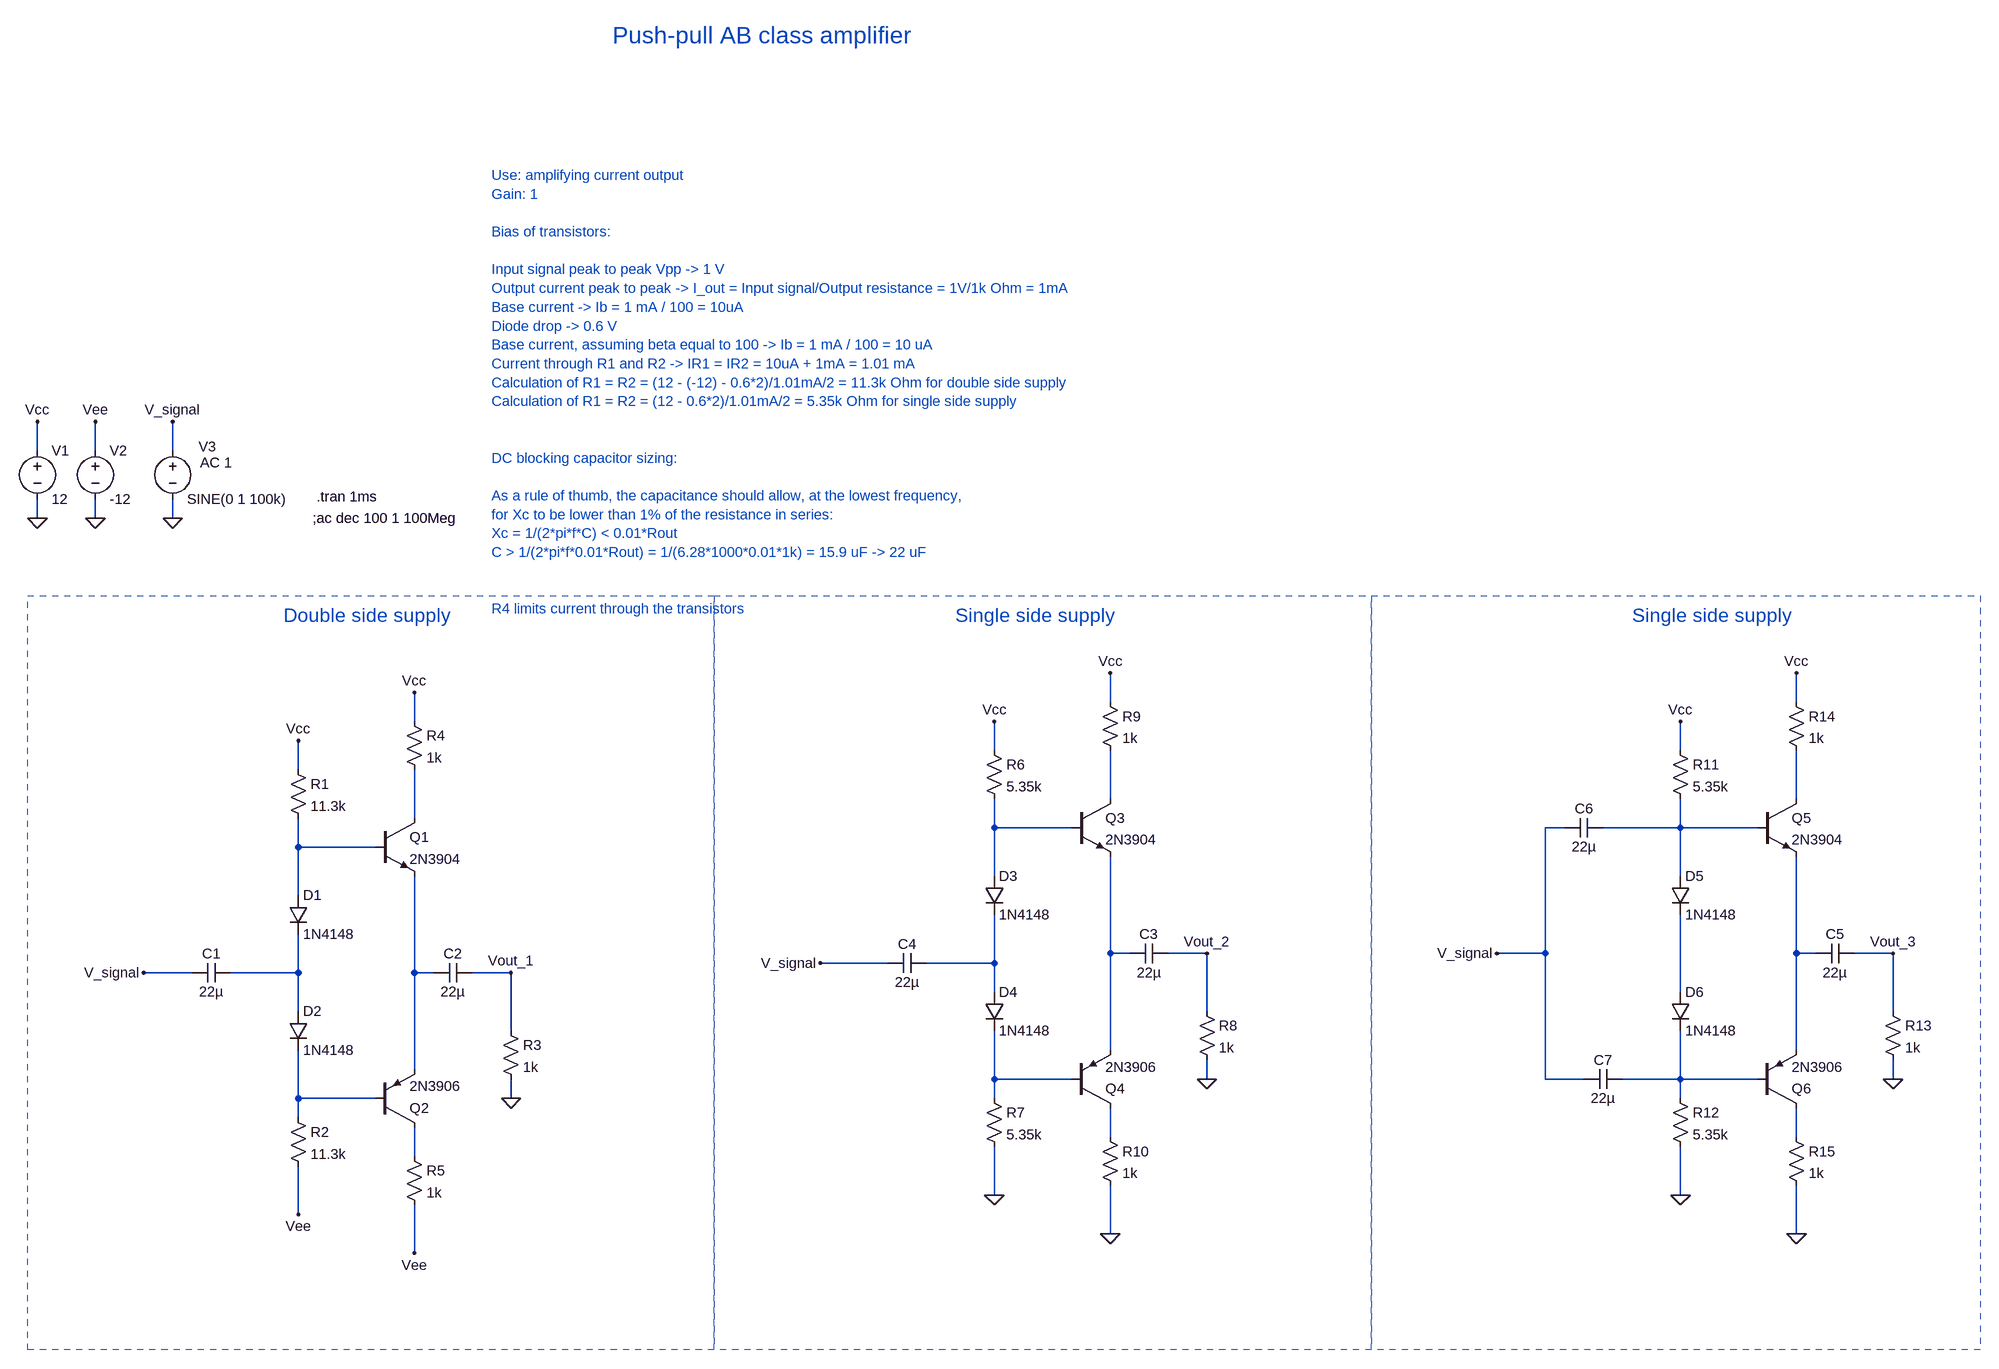
[diagram p0: schematic Push-pull-amplifier-AB-BJT.asc]
Push-pull-amplifier-AB-BJT.asc, the LTspice schematic file:
Version 4
SHEET 1 3188 900
WIRE -352 -592 -352 -640
WIRE -256 -592 -256 -640
WIRE -128 -592 -128 -640
WIRE -352 -480 -352 -512
WIRE -256 -480 -256 -512
WIRE -128 -480 -128 -512
WIRE 1424 -176 1424 -224
WIRE 2560 -176 2560 -224
WIRE 272 -144 272 -192
WIRE 1232 -96 1232 -144
WIRE 2368 -96 2368 -144
WIRE 80 -64 80 -112
WIRE 1424 -16 1424 -96
WIRE 2560 -16 2560 -96
WIRE 272 16 272 -64
WIRE 1232 32 1232 -16
WIRE 1360 32 1232 32
WIRE 2176 32 2144 32
WIRE 2368 32 2368 -16
WIRE 2368 32 2240 32
WIRE 2496 32 2368 32
WIRE 80 64 80 16
WIRE 208 64 80 64
WIRE 1232 112 1232 32
WIRE 2368 112 2368 32
WIRE 80 144 80 64
WIRE 1424 240 1424 80
WIRE 1456 240 1424 240
WIRE 1584 240 1520 240
WIRE 2144 240 2144 32
WIRE 2144 240 2064 240
WIRE 2560 240 2560 80
WIRE 2592 240 2560 240
WIRE 2720 240 2656 240
WIRE 1056 256 944 256
WIRE 1232 256 1232 176
WIRE 1232 256 1120 256
WIRE -96 272 -176 272
WIRE 80 272 80 208
WIRE 80 272 -32 272
WIRE 272 272 272 112
WIRE 304 272 272 272
WIRE 432 272 368 272
WIRE 1232 304 1232 256
WIRE 2368 304 2368 176
WIRE 80 336 80 272
WIRE 1584 336 1584 240
WIRE 2720 336 2720 240
WIRE 432 368 432 272
WIRE 1424 400 1424 240
WIRE 2560 400 2560 240
WIRE 272 432 272 272
WIRE 1232 448 1232 368
WIRE 1360 448 1232 448
WIRE 1584 448 1584 416
WIRE 2144 448 2144 240
WIRE 2208 448 2144 448
WIRE 2368 448 2368 368
WIRE 2368 448 2272 448
WIRE 2496 448 2368 448
WIRE 2720 448 2720 416
WIRE 80 480 80 400
WIRE 208 480 80 480
WIRE 432 480 432 448
WIRE 1232 480 1232 448
WIRE 2368 480 2368 448
WIRE 80 512 80 480
WIRE 1424 544 1424 496
WIRE 2560 544 2560 496
WIRE 272 576 272 528
WIRE 1232 640 1232 560
WIRE 2368 640 2368 560
WIRE 80 672 80 592
WIRE 1424 704 1424 624
WIRE 2560 704 2560 624
WIRE 272 736 272 656
FLAG -256 -480 0
FLAG -352 -480 0
FLAG -128 -480 0
FLAG -352 -640 Vcc
FLAG 80 -112 Vcc
FLAG 272 -192 Vcc
FLAG 80 672 Vee
FLAG 272 736 Vee
FLAG -256 -640 Vee
FLAG 432 480 0
FLAG 1232 -144 Vcc
FLAG 1424 -224 Vcc
FLAG 1584 448 0
FLAG 1232 640 0
FLAG 1424 704 0
FLAG 2368 -144 Vcc
FLAG 2560 -224 Vcc
FLAG 2720 448 0
FLAG 2368 640 0
FLAG 2560 704 0
FLAG -128 -640 V_signal
FLAG 944 256 V_signal
FLAG 2064 240 V_signal
FLAG -176 272 V_signal
FLAG 432 272 Vout_1
FLAG 1584 240 Vout_2
FLAG 2720 240 Vout_3
SYMBOL voltage -352 -608 R0
WINDOW 123 0 0 Left 0
WINDOW 39 0 0 Left 0
SYMATTR InstName V1
SYMATTR Value 12
SYMBOL voltage -256 -608 R0
WINDOW 123 0 0 Left 0
WINDOW 39 0 0 Left 0
SYMATTR InstName V2
SYMATTR Value -12
SYMBOL npn 208 16 R0
SYMATTR InstName Q1
SYMATTR Value 2N3904
SYMBOL pnp 208 528 M180
SYMATTR InstName Q2
SYMATTR Value 2N3906
SYMBOL res 64 -80 R0
SYMATTR InstName R1
SYMATTR Value 11.3k
SYMBOL diode 64 144 R0
SYMATTR InstName D1
SYMATTR Value 1N4148
SYMBOL diode 64 336 R0
SYMATTR InstName D2
SYMATTR Value 1N4148
SYMBOL res 64 496 R0
SYMATTR InstName R2
SYMATTR Value 11.3k
SYMBOL voltage -128 -608 R0
WINDOW 0 43 9 Left 2
WINDOW 123 45 36 Left 2
WINDOW 39 0 0 Left 0
SYMATTR InstName V3
SYMATTR Value SINE(0 1 100k)
SYMATTR Value2 AC 1
SYMBOL res 416 352 R0
SYMATTR InstName R3
SYMATTR Value 1k
SYMBOL cap -32 256 R90
WINDOW 0 0 32 VBottom 2
WINDOW 3 32 32 VTop 2
SYMATTR InstName C1
SYMATTR Value 22µ
SYMBOL cap 368 256 R90
WINDOW 0 0 32 VBottom 2
WINDOW 3 32 32 VTop 2
SYMATTR InstName C2
SYMATTR Value 22µ
SYMBOL res 256 560 R0
SYMATTR InstName R5
SYMATTR Value 1k
SYMBOL npn 1360 -16 R0
SYMATTR InstName Q3
SYMATTR Value 2N3904
SYMBOL pnp 1360 496 M180
SYMATTR InstName Q4
SYMATTR Value 2N3906
SYMBOL res 1216 -112 R0
SYMATTR InstName R6
SYMATTR Value 5.35k
SYMBOL diode 1216 112 R0
SYMATTR InstName D3
SYMATTR Value 1N4148
SYMBOL diode 1216 304 R0
SYMATTR InstName D4
SYMATTR Value 1N4148
SYMBOL res 1216 464 R0
SYMATTR InstName R7
SYMATTR Value 5.35k
SYMBOL res 1568 320 R0
SYMATTR InstName R8
SYMATTR Value 1k
SYMBOL cap 1520 224 R90
WINDOW 0 0 32 VBottom 2
WINDOW 3 32 32 VTop 2
SYMATTR InstName C3
SYMATTR Value 22µ
SYMBOL res 1408 528 R0
SYMATTR InstName R10
SYMATTR Value 1k
SYMBOL cap 1120 240 R90
WINDOW 0 0 32 VBottom 2
WINDOW 3 32 32 VTop 2
SYMATTR InstName C4
SYMATTR Value 22µ
SYMBOL npn 2496 -16 R0
SYMATTR InstName Q5
SYMATTR Value 2N3904
SYMBOL pnp 2496 496 M180
SYMATTR InstName Q6
SYMATTR Value 2N3906
SYMBOL res 2352 -112 R0
SYMATTR InstName R11
SYMATTR Value 5.35k
SYMBOL diode 2352 112 R0
SYMATTR InstName D5
SYMATTR Value 1N4148
SYMBOL diode 2352 304 R0
SYMATTR InstName D6
SYMATTR Value 1N4148
SYMBOL res 2352 464 R0
SYMATTR InstName R12
SYMATTR Value 5.35k
SYMBOL res 2704 320 R0
SYMATTR InstName R13
SYMATTR Value 1k
SYMBOL cap 2656 224 R90
WINDOW 0 0 32 VBottom 2
WINDOW 3 32 32 VTop 2
SYMATTR InstName C5
SYMATTR Value 22µ
SYMBOL res 2544 -192 R0
SYMATTR InstName R14
SYMATTR Value 1k
SYMBOL res 2544 528 R0
SYMATTR InstName R15
SYMATTR Value 1k
SYMBOL cap 2240 16 R90
WINDOW 0 0 32 VBottom 2
WINDOW 3 32 32 VTop 2
SYMATTR InstName C6
SYMATTR Value 22µ
SYMBOL cap 2272 432 R90
WINDOW 0 0 32 VBottom 2
WINDOW 3 32 32 VTop 2
SYMATTR InstName C7
SYMATTR Value 22µ
SYMBOL res 256 -160 R0
SYMATTR InstName R4
SYMATTR Value 1k
SYMBOL res 1408 -192 R0
SYMATTR InstName R9
SYMATTR Value 1k
TEXT 110 -516 Left 2 !.tran 1ms
TEXT 400 -1048 Left 2 ;Use: amplifying current output\nGain: 1\n \nBias of transistors:\n \nInput signal peak to peak Vpp -> 1 V\nOutput current peak to peak -> I_out = Input signal/Output resistance = 1V/1k Ohm = 1mA\nBase current -> Ib = 1 mA / 100 = 10uA\nDiode drop -> 0.6 V\nBase current, assuming beta equal to 100 -> Ib = 1 mA / 100 = 10 uA\nCurrent through R1 and R2 -> IR1 = IR2 = 10uA + 1mA = 1.01 mA\nCalculation of R1 = R2 = (12 - (-12) - 0.6*2)/1.01mA/2 = 11.3k Ohm for double side supply\nCalculation of R1 = R2 = (12 - 0.6*2)/1.01mA/2 = 5.35k Ohm for single side supply\n \n \nDC blocking capacitor sizing:\n \nAs a rule of thumb, the capacitance should allow, at the lowest frequency, \nfor Xc to be lower than 1% of the resistance in series:\nXc = 1/(2*pi*f*C) < 0.01*Rout \nC > 1/(2*pi*f*0.01*Rout) = 1/(6.28*1000*0.01*1k) = 15.9 uF -> 22 uF\n \n\nR4 limits current through the transistors
TEXT 104 -480 Left 2 !;ac dec 100 1 100Meg
TEXT 56 -320 Left 3 ;Double side supply
TEXT 1168 -320 Left 3 ;Single side supply
TEXT 2288 -320 Left 3 ;Single side supply
TEXT 600 -1280 Left 4 ;Push-pull AB class amplifier
RECTANGLE Normal 768 896 -368 -352 2
RECTANGLE Normal 1856 896 768 -352 2
RECTANGLE Normal 2864 896 1856 -352 2

The netlist it stands for:
* Push-pull-amplifier-AB-BJT.asc
V1 Vcc 0 12
V2 Vee 0 -12
Q1 N003 N006 N011 0 2N3904
Q2 N018 N015 N011 0 2N3906
R1 Vcc N006 11.3k
D1 N006 N010 1N4148
D2 N010 N015 1N4148
R2 N015 Vee 11.3k
V3 V_signal 0 SINE(0 1 100k) AC 1
R3 Vout_1 0 1k
C1 N010 V_signal 22µ
C2 Vout_1 N011 22µ
R5 N018 Vee 1k
Q3 N001 N004 N007 0 2N3904
Q4 N016 N013 N007 0 2N3906
R6 Vcc N004 5.35k
D3 N004 N009 1N4148
D4 N009 N013 1N4148
R7 N013 0 5.35k
R8 Vout_2 0 1k
C3 Vout_2 N007 22µ
R10 N016 0 1k
C4 N009 V_signal 22µ
Q5 N002 N005 N008 0 2N3904
Q6 N017 N014 N008 0 2N3906
R11 Vcc N005 5.35k
D5 N005 N012 1N4148
D6 N012 N014 1N4148
R12 N014 0 5.35k
R13 Vout_3 0 1k
C5 Vout_3 N008 22µ
R14 Vcc N002 1k
R15 N017 0 1k
C6 N005 V_signal 22µ
C7 N014 V_signal 22µ
R4 Vcc N003 1k
R9 Vcc N001 1k
.model D D
.lib standard.dio
.model NPN NPN
.model PNP PNP
.lib standard.bjt
.tran 1ms
* Use: amplifying current output
* Gain: 1
* Bias of transistors:
* Input signal peak to peak Vpp -> 1 V
* Output current peak to peak -> I_out = Input signal/Output resistance = 1V/1k Ohm = 1mA
* Base current -> Ib = 1 mA / 100 = 10uA
* Diode drop -> 0.6 V
* Base current, assuming beta equal to 100 -> Ib = 1 mA / 100 = 10 uA
* Current through R1 and R2 -> IR1 = IR2 = 10uA + 1mA = 1.01 mA
* Calculation of R1 = R2 = (12 - (-12) - 0.6*2)/1.01mA/2 = 11.3k Ohm for double side supply
* Calculation of R1 = R2 = (12 - 0.6*2)/1.01mA/2 = 5.35k Ohm for single side supply
* DC blocking capacitor sizing:
* As a rule of thumb, the capacitance should allow, at the lowest frequency,
* for Xc to be lower than 1% of the resistance in series:
* Xc = 1/(2*pi*f*C) < 0.01*Rout
* C > 1/(2*pi*f*0.01*Rout) = 1/(6.28*1000*0.01*1k) = 15.9 uF -> 22 uF
* R4 limits current through the transistors
;ac dec 100 1 100Meg
* Double side supply
* Single side supply
* Single side supply
* Push-pull AB class amplifier
.backanno
.end